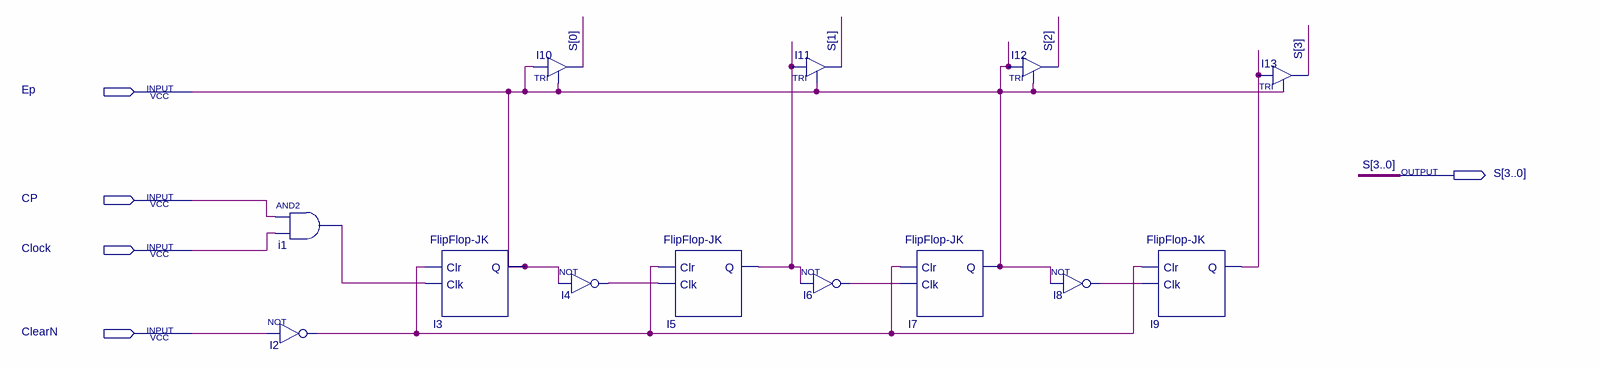
[diagram p0: schematic sheet]
// Quartus schematic Contador-Programa.bdf as structural Verilog: 13 symbols, 5 pins
module \Contador-Programa  (
  input  Ep,
  input  CP,
  input  Clock,
  input  ClearN,
  output [3:0] S
);

  wire i1_out, I2_out, I4_out, I5_q, I6_out, I8_out, I9_q;

  and i1 (i1_out, CP, Clock);
  not I2 (I2_out, ClearN);
  \FlipFlop-JK  I3 (.Clr(I2_out), .Clk(i1_out), .Q(Ep));
  TRI I10 (.IN(Ep), .OE(Ep), .OUT(S[0]));
  not I4 (I4_out, Ep);
  \FlipFlop-JK  I5 (.Clr(I2_out), .Clk(I4_out), .Q(I5_q));
  TRI I11 (.IN(I5_q), .OE(Ep), .OUT(S[1]));
  not I6 (I6_out, I5_q);
  \FlipFlop-JK  I7 (.Clr(I2_out), .Clk(I6_out), .Q(Ep));
  TRI I12 (.IN(Ep), .OE(Ep), .OUT(S[2]));
  not I8 (I8_out, Ep);
  \FlipFlop-JK  I9 (.Clr(I2_out), .Clk(I8_out), .Q(I9_q));
  TRI I13 (.IN(I9_q), .OE(Ep), .OUT(S[3]));
endmodule
